# Altium project DC_CDI_Honda_CX500_rev2.1.PrjPcb
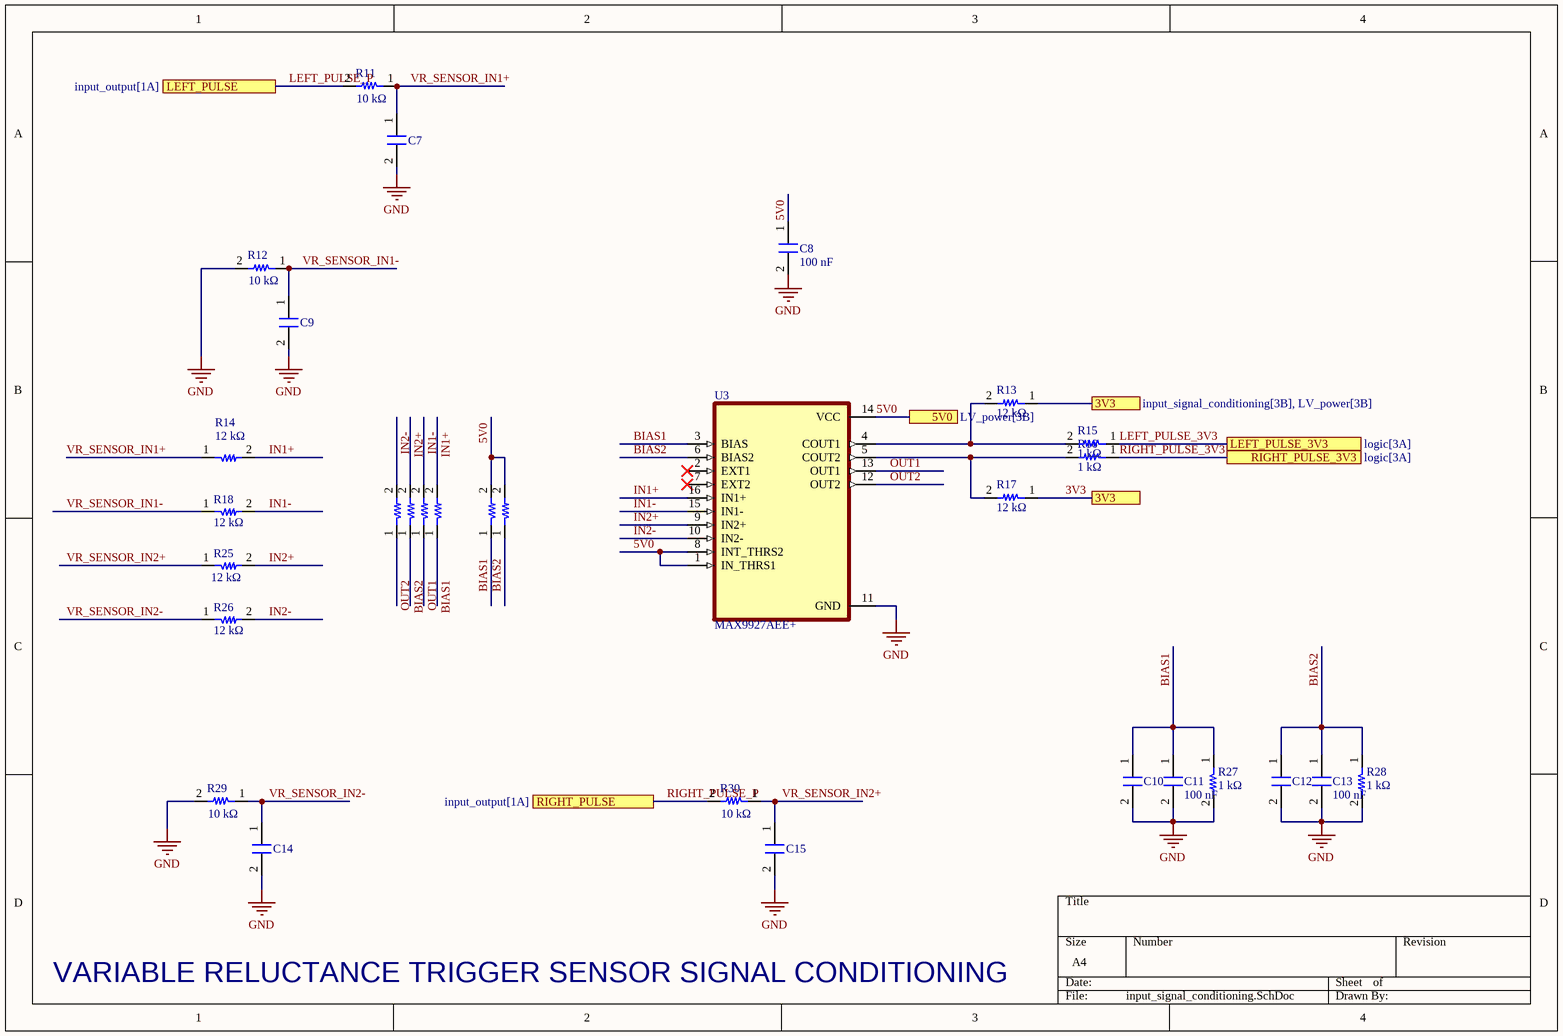
[diagram p0: input_signal_conditioning.SchDoc]
4 sheets, 117 parts. Net scope: flat (ports and power ports of the same name join across sheets).
Board file: dc_cdi_cx500.PcbDoc
Sheets:
  input_signal_conditioning.SchDoc
  logic.SchDoc
  HV_power.SchDoc
  LV_power.SchDoc

## Sheet input_signal_conditioning.SchDoc
size A4; SheetNumber: 3; SheetTotal: 6

### Parts
C7  Capacitor_0402  [0402_fp]  (value not drawn)
C8  value 100 nF  [0402_fp]  (hidden comment: Capacitor_0402)
C9  Capacitor_0402  [0402_fp]  (value not drawn)
C10  Capacitor_0603  [0603_FP]  (value not drawn)
C11  value 100 nF  [0402_fp]  (hidden comment: Capacitor_0402)
C12  Capacitor_0603  [0603_FP]  (value not drawn)
C13  value 100 nF  [0402_fp]  (hidden comment: Capacitor_0402)
C14  Capacitor_0402  [0402_fp]  (value not drawn)
C15  Capacitor_0402  [0402_fp]  (value not drawn)
R11  value 10 kΩ  [0402_fp]  (hidden comment: Resistor_0402)
R12  value 10 kΩ  [0402_fp]  (hidden comment: Resistor_0402)
R13  value 12 kΩ  [0402_fp]  (hidden comment: Resistor_0402)
R14  value 12 kΩ  [0402_fp]  (hidden comment: Resistor_0402)
R15  value 1 kΩ  [0402_fp]  (hidden comment: Resistor_0402)
R16  value 1 kΩ  [0402_fp]  (hidden comment: Resistor_0402)
R17  value 12 kΩ  [0402_fp]  (hidden comment: Resistor_0402)
R18  value 12 kΩ  [0402_fp]  (hidden comment: Resistor_0402)
R19  Resistor_0402  [0402_fp]  (value not drawn)
R20  Resistor_0402  [0402_fp]  (value not drawn)
R21  Resistor_0402  [0402_fp]  (value not drawn)
R22  Resistor_0402  [0402_fp]  (value not drawn)
R23  Resistor_0402  [0402_fp]  (value not drawn)
R24  Resistor_0402  [0402_fp]  (value not drawn)
R25  value 12 kΩ  [0402_fp]  (hidden comment: Resistor_0402)
R26  value 12 kΩ  [0402_fp]  (hidden comment: Resistor_0402)
R27  value 1 kΩ  [0402_fp]  (hidden comment: Resistor_0402)
R28  value 1 kΩ  [0402_fp]  (hidden comment: Resistor_0402)
R29  value 10 kΩ  [0402_fp]  (hidden comment: Resistor_0402)
R30  value 10 kΩ  [0402_fp]  (hidden comment: Resistor_0402)
U3  MAX9927AEE+  [SOP63P602X175-16N]

### Ports
3V3 (see input_signal_conditioning[3B], LV_power[3B]), 5V0 (see LV_power[3B]), LEFT_PULSE (see input_output[1A]), LEFT_PULSE_3V3 (see logic[3A]), RIGHT_PULSE (see input_output[1A]), RIGHT_PULSE_3V3 (see logic[3A])

### Nets
3V3: R13.1 R17.1 ; port 3V3
5V0: C8.1 R23.2 R24.2 U3.1(IN_THRS1) U3.8(INT_THRS2) U3.14(VCC) ; port 5V0
GND: C7.2 C8.2 C9.2 C10.2 C11.2 C12.2 C13.2 C14.2 C15.2 R12.2 R27.2 R28.2 R29.2 U3.11(GND)
BIAS1: C10.1 C11.1 R22.1 R23.1 R27.1 U3.3(BIAS)
BIAS2: C12.1 C13.1 R20.1 R24.1 R28.1 U3.6(BIAS2)
IN1+: R14.2 R22.2 U3.16(IN1+)
IN1-: R18.2 R21.2 U3.15(IN1-)
IN2+: R20.2 R25.2 U3.9(IN2+)
IN2-: R19.2 R26.2 U3.10(IN2-)
LEFT_PULSE_3V3: R15.1 ; port LEFT_PULSE_3V3
LEFT_PULSE_P: R11.2 ; port LEFT_PULSE
OUT1: R21.1 U3.13(OUT1)
OUT2: R19.1 U3.12(OUT2)
RIGHT_PULSE_3V3: R16.1 ; port RIGHT_PULSE_3V3
RIGHT_PULSE_P: R30.2 ; port RIGHT_PULSE
VR_SENSOR_IN1+: C7.1 R11.1 R14.1
VR_SENSOR_IN1-: C9.1 R12.1 R18.1
VR_SENSOR_IN2+: C15.1 R25.1 R30.1
VR_SENSOR_IN2-: C14.1 R26.1 R29.1
NetR13_2: R13.2 R15.2 U3.4(COUT1)
NetR16_2: R16.2 R17.2 U3.5(COUT2)

Not connected (* = marked no-connect by the designer): U3 2(EXT1)* 7(EXT2)*

### Notes on the sheet
- VARIABLE RELUCTANCE TRIGGER SENSOR SIGNAL CONDITIONING

### Library data of the parts
C7 C9 C14 C15 = Capacitor_0402: Value: 1 nF; Format: 0402; Package: 0402
C8 C11 C13 = Capacitor_0402: Format: 0402; Package: 0402
C10 C12 = Capacitor_0603: Value: 10 uF; Format: 0402; Package: 0402
R11-R18 R25-R30 = Resistor_0402: Format: 0402; Package: 0402
R19-R22 = Resistor_0402: Value: 12 kΩ; Format: 0402; Package: 0402
R23 R24 = Resistor_0402: Value: 1 kΩ; Format: 0402; Package: 0402
U3 = MAX9927AEE+: Variable-Reluctance Sensor Interface with Differential Input and Adaptive Peak Threshold; MF: Analog Devices; SnapEDA_Link: https://www.snapeda.com/parts/MAX9927AEE+/Analog+Devices/view-part/?ref=snap; Package: QSOP-16 Maxim; Value: *; MP: MAX9927AEE+; Check_prices: https://www.snapeda.com/parts/MAX9927AEE+/Analog+Devices/view-part/?ref=eda

## Sheet logic.SchDoc
size A4; SheetNumber: 4; SheetTotal: 6
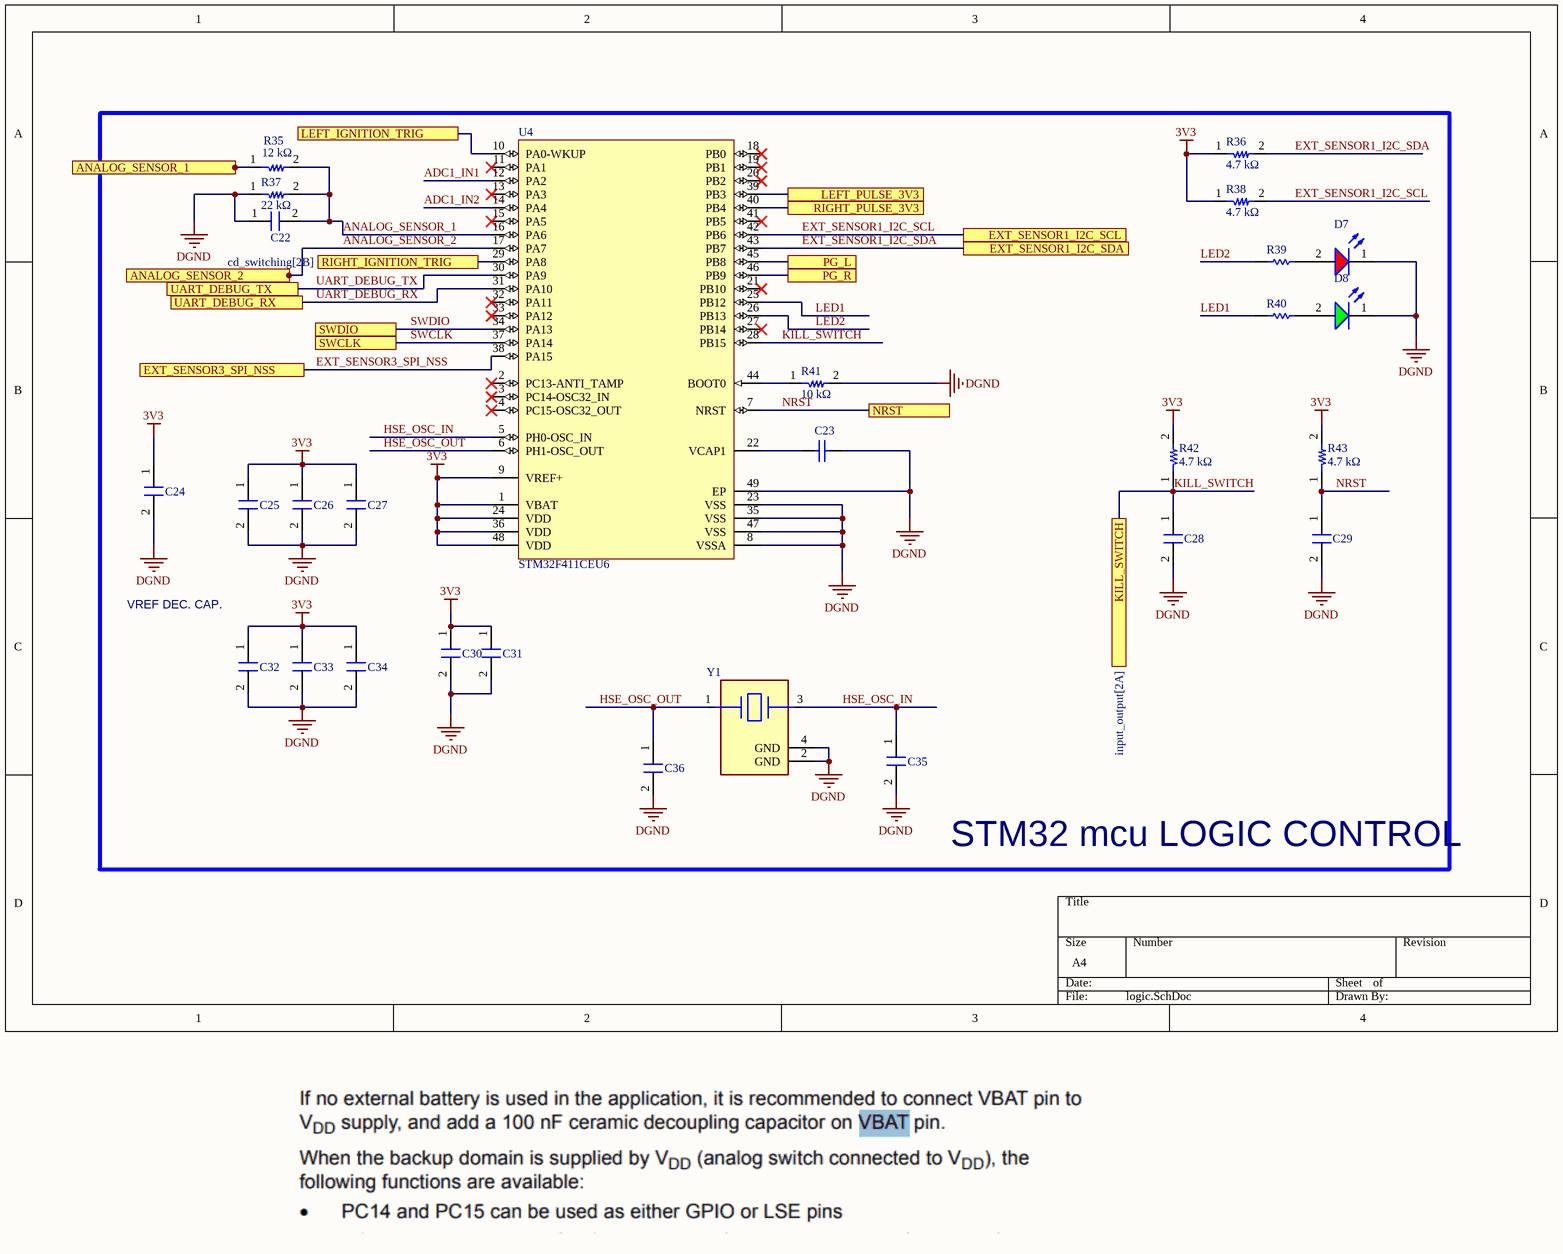
[diagram p1: logic.SchDoc]

### Parts
C22  Capacitor_0402  [0402_fp]  (value not drawn)
C23  0603ZD475MAT2A  [CAPC1608X90X35NL15T15]  (value not drawn)
C24  Capacitor_0402  [0402_fp]  (value not drawn)
C25  Capacitor_0402  [0402_fp]  (value not drawn)
C26  Capacitor_0402  [0402_fp]  (value not drawn)
C27  Capacitor_0402  [0402_fp]  (value not drawn)
C28  Capacitor_0402  [0402_fp]  (value not drawn)
C29  Capacitor_0402  [0402_fp]  (value not drawn)
C30  Capacitor_0402  [0402_fp]  (value not drawn)
C31  Capacitor_0402  [0402_fp]  (value not drawn)
C32  Capacitor_0402  [0402_fp]  (value not drawn)
C33  Capacitor_0402  [0402_fp]  (value not drawn)
C34  Capacitor_0402  [0402_fp]  (value not drawn)
C35  Capacitor_0603  [0603_FP]  (value not drawn)
C36  Capacitor_0603  [0603_FP]  (value not drawn)
D7  150080RS75000  [WL-SMCW_0805_150080xx75000]  (value not drawn)
D8  150080GS75000  [WL-SMCW_0805_150080xx75000]  (value not drawn)
R35  value 12 kΩ  [0402_fp]  (hidden comment: Resistor_0402)
R36  value 4.7 kΩ  [0402_fp]  (hidden comment: Resistor_0402)
R37  value 22 kΩ  [0402_fp]  (hidden comment: Resistor_0402)
R38  value 4.7 kΩ  [0402_fp]  (hidden comment: Resistor_0402)
R39  MCS04020D5600BE100  [RESC1005X37X20NL05T10]  (value not drawn)
R40  MCS04020D5600BE100  [RESC1005X37X20NL05T10]  (value not drawn)
R41  value 10 kΩ  [0402_fp]  (hidden comment: Resistor_0402)
R42  value 4.7 kΩ  [0402_fp]  (hidden comment: Resistor_0402)
R43  value 4.7 kΩ  [0402_fp]  (hidden comment: Resistor_0402)
U4  STM32F411CEU6  [STM-UFQFPN48_L]
Y1  NX3225GA-16.000M-STD-CRG-2  [FP-NX3225GA-MFG]  (value not drawn)

### Ports
ANALOG_SENSOR_1 (see input_output[1B]), ANALOG_SENSOR_2, EXT_SENSOR1_I2C_SCL (see input_output[1B]), EXT_SENSOR1_I2C_SDA (see input_output[1B]), EXT_SENSOR3_SPI_NSS, KILL_SWITCH (see input_output[2A]), LEFT_IGNITION_TRIG (see cd_switching[2B]), LEFT_PULSE_3V3 (see input_signal_conditioning[4B]), NRST (see input_output[3B]), PG_L (see HV_power[4B]), PG_R (see HV_power[4C]), RIGHT_IGNITION_TRIG (see cd_switching[2B]), RIGHT_PULSE_3V3 (see input_signal_conditioning[4B]), SWCLK (see input_output[3A]), SWDIO (see input_output[3A]), UART_DEBUG_RX (see input_output[2B], input_output[3C]), UART_DEBUG_TX (see input_output[2A], input_output[3B])

### Nets
3V3: C24.1 C25.1 C26.1 C27.1 C30.1 C31.1 C32.1 C33.1 C34.1 R36.1 R38.1 R42.2 R43.2 U4.1(VBAT) U4.9(VREF+) U4.24(VDD) U4.36(VDD) U4.48(VDD)
DGND: C22.1 C23.2 C24.2 C25.2 C26.2 C27.2 C28.2 C29.2 C30.2 C31.2 C32.2 C33.2 C34.2 C35.2 C36.2 D7.1(K) D8.1(K) R37.1 R41.2 U4.8(VSSA) U4.23(VSS) U4.35(VSS) U4.47(VSS) U4.49(EP) Y1.2(GND) Y1.4(GND)
ADC1_IN1: U4.12(PA2)
ADC1_IN2: U4.14(PA4)
ANALOG_SENSOR_1: C22.2 R35.2 R37.2 U4.16(PA6)
ANALOG_SENSOR_2: U4.17(PA7) ; port ANALOG_SENSOR_2
EXT_SENSOR1_I2C_SCL: R38.2 U4.42(PB6) ; port EXT_SENSOR1_I2C_SCL
EXT_SENSOR1_I2C_SDA: R36.2 U4.43(PB7) ; port EXT_SENSOR1_I2C_SDA
EXT_SENSOR3_SPI_NSS: U4.38(PA15) ; port EXT_SENSOR3_SPI_NSS
HSE_OSC_IN: C35.1 U4.5(PH0-OSC_IN) Y1.3
HSE_OSC_OUT: C36.1 U4.6(PH1-OSC_OUT) Y1.1
KILL_SWITCH: C28.1 R42.1 U4.28(PB15) ; port KILL_SWITCH
LED1: R40.1 U4.25(PB12)
LED2: R39.1 U4.26(PB13)
LEFT_PULSE_3V3: U4.39(PB3) ; port LEFT_PULSE_3V3
NRST: C29.1 R43.1 U4.7(NRST) ; port NRST
RIGHT_PULSE_3V3: U4.40(PB4) ; port RIGHT_PULSE_3V3
SWCLK: U4.37(PA14) ; port SWCLK
SWDIO: U4.34(PA13) ; port SWDIO
UART_DEBUG_RX: U4.31(PA10) ; port UART_DEBUG_RX
UART_DEBUG_TX: U4.30(PA9) ; port UART_DEBUG_TX
NetC23_1: C23.1 U4.22(VCAP1)
NetD7_2: D7.2(A) R39.2
NetD8_2: D8.2(A) R40.2
NetD11_1: U4.45(PB8) ; port PG_L
NetD14_1: U4.46(PB9) ; port PG_R
NetR35_1: R35.1 ; port ANALOG_SENSOR_1
NetR41_1: R41.1 U4.44(BOOT0)
NetU4_10: U4.10(PA0-WKUP) ; port LEFT_IGNITION_TRIG
NetU4_29: U4.29(PA8) ; port RIGHT_IGNITION_TRIG

Not connected (* = marked no-connect by the designer): U4 2(PC13-ANTI_TAMP)* 3(PC14-OSC32_IN)* 4(PC15-OSC32_OUT)* 11(PA1)* 13(PA3)* 15(PA5)* 18(PB0)* 19(PB1)* 20(PB2)* 21(PB10)* 27(PB14)* 32(PA11)* 33(PA12)* 41(PB5)*

### Notes on the sheet
- VREF DEC. CAP.
- STM32 mcu LOGIC CONTROL

### Library data of the parts
C22 = Capacitor_0402: Value: 1 nF; Format: 0402; Package: 0402
C23 = CMP-1035-02787-2: Manufacturer: AVX Interconnect / Elco; Part Number: 0603ZD475MAT2A
C24 C28 C29 = Capacitor_0402: Value: 100 nF; Format: 0402; Package: 0402
C25-C27 C30-C34 = Capacitor_0402: Value: 10 nF; Format: 0402; Package: 0402
C35 C36 = Capacitor_0603: Value: 10 pF; Format: 0402; Package: 0402
D7 = CMP-1426-00011-3: LED Uni-Color Red 630nm 2-Pin Chip 0805(2012Metric) T/R; Viewing Angle: 140°; Max Junction Temperature (Tj): 95°C; Power Dissipation: 72mW; Forward Current: 100mA; Forward Voltage: 2V; Wavelength: 625nm; Test Current: 20mA; Max Reverse Voltage (DC): 5V; Luminous Intensity: 150mcd; Lens Style: Clear, Rectangular; REACH SVHC: Unknown; Height: 700µm; Case Code (Metric): 2012; Peak Wavelength: 630nm; Length: 2mm; Width: 1.25mm; RoHS: Compliant; Packaging: Tape and Reel; Dominant Wavelength: 625nm; Color: Red; Case Code (Imperial): 0805; Min Operating Temperature: -40°C; Mount: Surface Mount; Max Operating Temperature: 85°C; Case/Package: 0805
D8 = CMP-1426-00007-3: WURTH ELEKTRONIK - 150080GS75000 - LED, Green, SMD, 0805, 30 mA, 3.2 V, 520 nm; Forward Voltage: 3.2V; Viewing Angle: 140°; Power Dissipation: 105mW; Peak Wavelength: 515nm; Max Reverse Voltage (DC): 5V; Luminous Intensity: 450mcd; Wavelength: 525nm; Max Junction Temperature (Tj): 95°C; Forward Current: 100mA; Test Current: 20mA; Lens Style: Clear, Rectangular; Length: 2mm; Case/Package: 0805; Case Code (Metric): 2012; Color: Green; Height: 700µm; Width: 1.25mm; Packaging: Tape and Reel; Mount: Surface Mount; REACH SVHC: Unknown; RoHS: Compliant; Min Operating Temperature: -40°C; Reverse Voltage: 5V; Max Operating Temperature: 85°C; Dominant Wavelength: 525nm; Case Code (Imperial): 0805
R39 R40 = CMP-2002-02518-1: Manufacturer: Vishay BCcomponents; Part Number: MCS04020D5600BE100
U4 = CMP-0243-00165-1: ARM Cortex-M4 32-bit MCU+FPU, 512 KB Flash, 128 KB RAM, 36 I/Os, 48-Pin UFQFPN, -40 to 85 degC, Tray; Operating Frequency(F) (Processor speed) (MHz): 100; FLASH Size (Prog) (kB): 512; Internal RAM Size (kB): 128; I/Os (High Current): 36; Supply Voltage(Vcc) min (V): 1.7; Package Reference: 48-Pin Ultra Thin Fine Pitch Quad Flat No-Lead, 7 x 7 x 0.6 mm Body, 0.5 mm Pitch, Exposed Pad; ComponentLink1Description: Manufacturer URL; ComponentLink1URL: http://www.st.com/; Packing: Tray; Package Description: UFQFPN48; Core: ARM Cortex-M4; ComponentLink2Description: Datasheet; ComponentLink2URL: http://www.st.com/st-web-ui/static/active/en/resource/technical/document/datasheet/DM00115249.pdf; DatasheetVersion: Rev. 6; Mounting Technology: Surface Mount
Y1 = CMP-200220-000007-1: CRYSTAL 16.0000MHZ 8PF SMD; Frequency Stability: 30ppm; Frequency Tolerance: 20ppm; Frequency: 16MHz; ESR (Equivalent Series Resistance): 80R; Min Operating Temperature: -40°C; Mount: Surface Mount; Width: 0.098inch; Case/Package: SMD/SMT; Max Operating Temperature: 85°C; Number of Pins: 4; Length: 0.126inch; Load Capacitance: 8pF; Packaging: Tape and Reel; Package Quantity: 3000; Height: 0.035inch
R35-R38 R41-R43 = Resistor_0402: Package: 0402

## Sheet HV_power.SchDoc
size A4; SheetNumber: 5; SheetTotal: 6
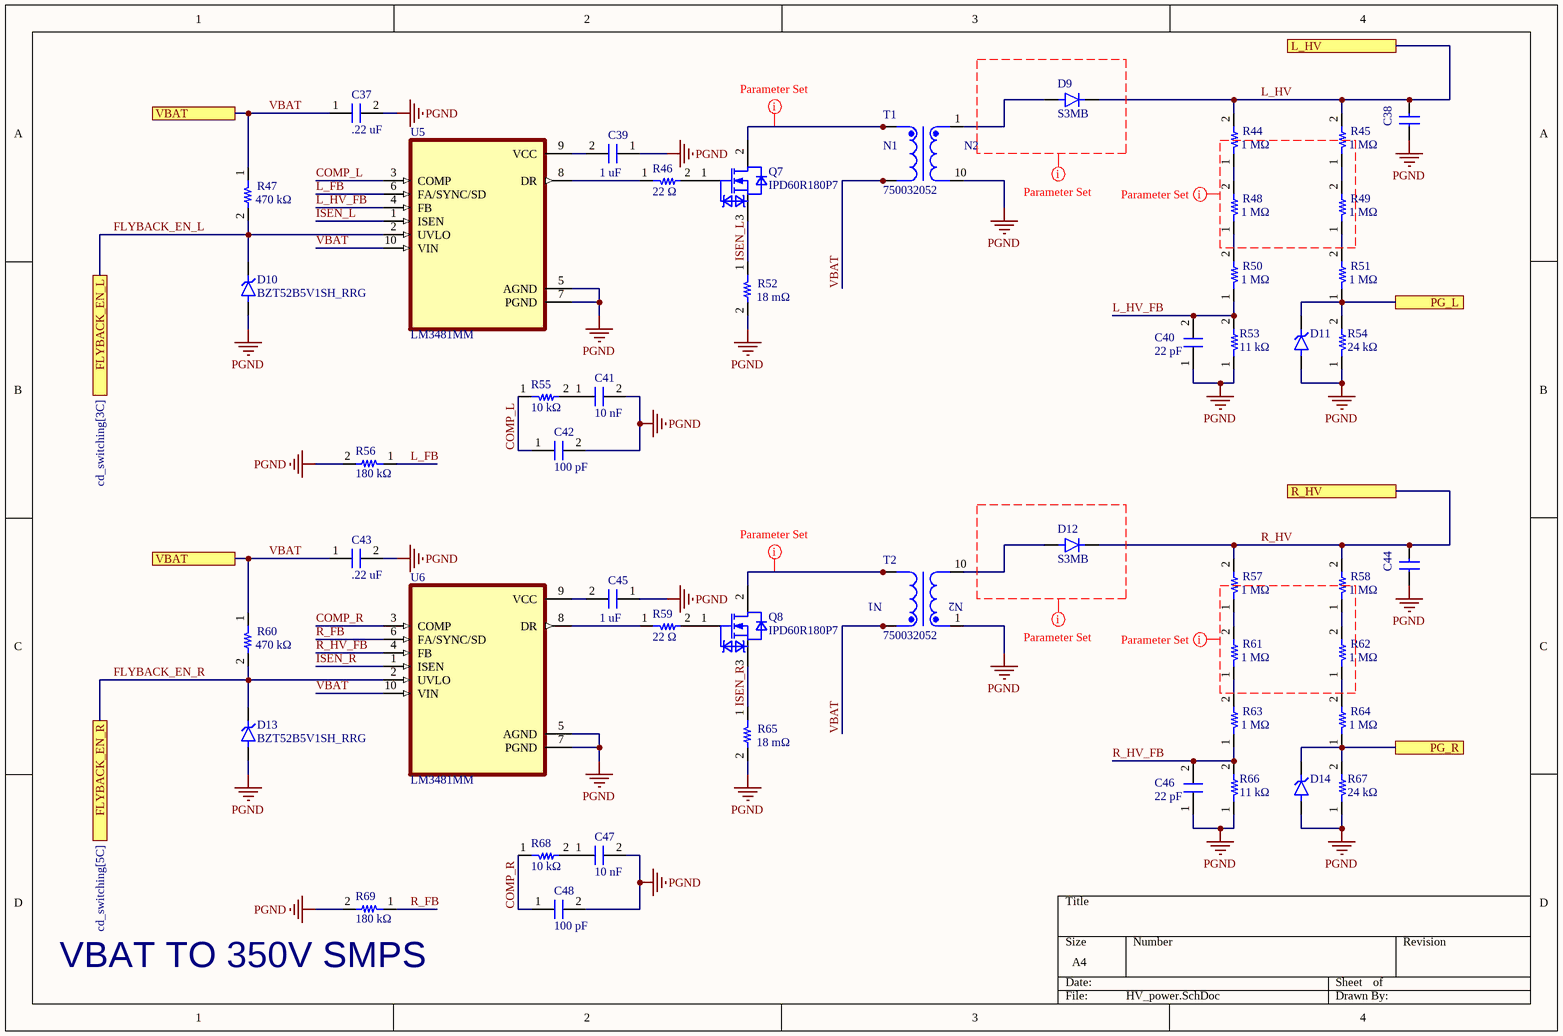
[diagram p2: HV_power.SchDoc]

### Parts
C37  value .22 uF  [0603_FP]  (hidden comment: GRM21BR61C475KA88L)
C38  WCAP-FTBP_P10  [WCAP-FTBP_10X13X5.5X11(PXLXWXH)]  (value not drawn)
C39  value 1 uF  [0603_FP]  (hidden comment: Capacitor_0603)
C40  value 22 pF  [0603_FP]  (hidden comment: Capacitor_0603)
C41  value 10 nF  [0603_FP]  (hidden comment: Capacitor_0603)
C42  value 100 pF  [0603_FP]  (hidden comment: Capacitor_0603)
C43  value .22 uF  [0603_FP]  (hidden comment: GRM21BR61C475KA88L)
C44  WCAP-FTBP_P10  [WCAP-FTBP_10X13X5.5X11(PXLXWXH)]  (value not drawn)
C45  value 1 uF  [0603_FP]  (hidden comment: Capacitor_0603)
C46  value 22 pF  [0603_FP]  (hidden comment: Capacitor_0603)
C47  value 10 nF  [0603_FP]  (hidden comment: Capacitor_0603)
C48  value 100 pF  [0603_FP]  (hidden comment: Capacitor_0603)
D9  S3MB  [DIOM4336X265N]
D10  BZT52B5V1SH_RRG  [DIO_BZT52B5V1SH_RRG]
D11  BZT52B15SH_RRG  [DIO_BZT52B15SH_RRG]  (value not drawn)
D12  S3MB  [DIOM4336X265N]
D13  BZT52B5V1SH_RRG  [DIO_BZT52B5V1SH_RRG]
D14  BZT52B15SH_RRG  [DIO_BZT52B15SH_RRG]  (value not drawn)
Q7  IPD60R180P7  [DPAK228P987X240-3N]
Q8  IPD60R180P7  [DPAK228P987X240-3N]
R44  value 1 MΩ  [0805_FP]  (hidden comment: R_0805)
R45  value 1 MΩ  [0805_FP]  (hidden comment: R_0805)
R46  value 22 Ω  [0603_FP]  (hidden comment: Resistor_0603)
R47  value 470 kΩ  [0603_FP]  (hidden comment: Resistor_0603)
R48  value 1 MΩ  [0805_FP]  (hidden comment: R_0805)
R49  value 1 MΩ  [0805_FP]  (hidden comment: R_0805)
R50  value 1 MΩ  [0805_FP]  (hidden comment: R_0805)
R51  value 1 MΩ  [0805_FP]  (hidden comment: R_0805)
R52  value 18 mΩ  [2010_FP]  (hidden comment: 2010_res)
R53  value 11 kΩ  [0805_FP]  (hidden comment: R_0805)
R54  value 24 kΩ  [0805_FP]  (hidden comment: R_0805)
R55  value 10 kΩ  [0603_FP]  (hidden comment: Resistor_0603)
R56  value 180 kΩ  [0603_FP]  (hidden comment: Resistor_0603)
R57  value 1 MΩ  [0805_FP]  (hidden comment: R_0805)
R58  value 1 MΩ  [0805_FP]  (hidden comment: R_0805)
R59  value 22 Ω  [0603_FP]  (hidden comment: Resistor_0603)
R60  value 470 kΩ  [0603_FP]  (hidden comment: Resistor_0603)
R61  value 1 MΩ  [0805_FP]  (hidden comment: R_0805)
R62  value 1 MΩ  [0805_FP]  (hidden comment: R_0805)
R63  value 1 MΩ  [0805_FP]  (hidden comment: R_0805)
R64  value 1 MΩ  [0805_FP]  (hidden comment: R_0805)
R65  value 18 mΩ  [2010_FP]  (hidden comment: 2010_res)
R66  value 11 kΩ  [0805_FP]  (hidden comment: R_0805)
R67  value 24 kΩ  [0805_FP]  (hidden comment: R_0805)
R68  value 10 kΩ  [0603_FP]  (hidden comment: Resistor_0603)
R69  value 180 kΩ  [0603_FP]  (hidden comment: Resistor_0603)
T1  750032052  [WE-FB3751_EFD20]
T2  750032052  [WE-FB3751_EFD20]
U5  LM3481MM  [SOP50P490X110-10N]
U6  LM3481MM  [SOP50P490X110-10N]

### Ports
FLYBACK_EN_L (see cd_switching[3C]), FLYBACK_EN_R (see cd_switching[5C]), L_HV (see cd_switching[4A]), PG_L (see logic[3B]), PG_R (see logic[3B]), R_HV (see cd_switching[6B]), VBAT (see cd_switching[3A], cd_switching[3B], HV_power[1A], input_output[2D], LV_power[1B]), VBAT (see cd_switching[3A], cd_switching[3B], HV_power[1C], input_output[2D], LV_power[1B])

### Nets
PGND: C37.2 C38.1 C39.1 C40.1 C41.2 C42.2 C43.2 C44.1 C45.1 C46.1 C47.2 C48.2 D10.2(A) D11.2(A) D13.2(A) D14.2(A) R52.2 R53.1 R54.1 R56.2 R65.2 R66.1 R67.1 R69.2 T1.10 T2.1 U5.5(AGND) U5.7(PGND) U6.5(AGND) U6.7(PGND)
COMP_L: C42.1 R55.1 U5.3(COMP)
COMP_R: C48.1 R68.1 U6.3(COMP)
FLYBACK_EN_L: D10.1(K) R47.2 U5.2(UVLO) ; port FLYBACK_EN_L
FLYBACK_EN_R: D13.1(K) R60.2 U6.2(UVLO) ; port FLYBACK_EN_R
ISEN_L: Q7.3(SOURCE) R52.1 U5.1(ISEN)
ISEN_R: Q8.3(SOURCE) R65.1 U6.1(ISEN)
L_FB: R56.1 U5.6(FA/SYNC/SD)
L_HV: C38.2 D9.C(K) R44.2 R45.2 ; port L_HV
L_HV_FB: C40.2 R50.1 R53.2 U5.4(FB)
R_FB: R69.1 U6.6(FA/SYNC/SD)
R_HV: C44.2 D12.C(K) R57.2 R58.2 ; port R_HV
R_HV_FB: C46.2 R63.1 R66.2 U6.4(FB)
VBAT: C37.1 C43.1 R47.1 R60.1 T1.4(4+5) T1.5(4+5) T2.6(6+7) T2.7(6+7) U5.10(VIN) U6.10(VIN) ; port VBAT
NetC39_2: C39.2 U5.9(VCC)
NetC41_1: C41.1 R55.2
NetC45_2: C45.2 U6.9(VCC)
NetC47_1: C47.1 R68.2
NetD9_A: D9.A T1.1
NetD11_1: D11.1(K) R51.1 R54.2 ; port PG_L
NetD12_A: D12.A T2.10
NetD14_1: D14.1(K) R64.1 R67.2 ; port PG_R
NetQ7_1: Q7.1(GATE) R46.2
NetQ7_2: Q7.2(DRAIN) T1.6(6+7) T1.7(6+7)
NetQ8_1: Q8.1(GATE) R59.2
NetQ8_2: Q8.2(DRAIN) T2.4(4+5) T2.5(4+5)
NetR44_1: R44.1 R48.2
NetR45_1: R45.1 R49.2
NetR46_1: R46.1 U5.8(DR)
NetR48_1: R48.1 R50.2
NetR49_1: R49.1 R51.2
NetR57_1: R57.1 R61.2
NetR58_1: R58.1 R62.2
NetR59_1: R59.1 U6.8(DR)
NetR61_1: R61.1 R63.2
NetR62_1: R62.1 R64.2

### Layout directives
net class HV_NETS: (no net found under the mark), NetQ7_2, NetQ8_2
net class FB_NETS: (no net found under the mark)

### Notes on the sheet
- (near R69) VBAT TO 350V SMPS
- (in symbol 750032052) N1; N2

### Library data of the parts
C37 C39-C43 C45-C48 = Capacitor_0603: Format: 0402; Package: 0402
C38 C44 = WCAP-FTBP_P10: MPPP010104J400DCPP55004; THT Boxed; 100 nF Â± 5 %; 400V (DC); RIso â‰¥ 30 GÎ©; pitch 10; Climate category 40/105/56; MF: Wurth Elektronik; MP: 890283323005CS; SnapEDA_Link: https://www.snapeda.com/parts/890283323005CS/Wurth+Electronics/view-part/?ref=snap; Package: None; Value: *; Check_prices: https://www.snapeda.com/parts/890283323005CS/Wurth+Electronics/view-part/?ref=eda
D9 D12 = S3MB: 3A, 1000V, Standard Recovery Rectifier; MF: Taiwan Semiconductor; SnapEDA_Link: https://www.snapeda.com/parts/S3MB/taiwan/view-part/?ref=snap; Package: SMD-2 Taiwan Semiconductor; Value: *; MP: S3MB; Check_prices: https://www.snapeda.com/parts/S3MB/taiwan/view-part/?ref=eda
D10 D13 = BZT52B5V1SH_RRG: SOD-323, 200mW, 2%, 5.1V, Zener Diode; MF: Taiwan Semiconductor Corporation; MP: BZT52B5V1SH RRG; SnapEDA_Link: https://www.snapeda.com/parts/BZT52B5V1SH%20RRG/Taiwan+Semiconductor+Corporation/view-part/?ref=snap; Package: SOD-323-2 Taiwan Semiconductor; Value: *; Check_prices: https://www.snapeda.com/parts/BZT52B5V1SH%20RRG/Taiwan+Semiconductor+Corporation/view-part/?ref=eda
D11 D14 = BZT52B15SH_RRG: SOD-323, 200mW, 2%, 15V, Zener Diode; MF: Taiwan Semiconductor Corporation; MP: BZT52B15SH RRG; SnapEDA_Link: https://www.snapeda.com/parts/BZT52B15SH%20RRG/Taiwan+Semiconductor+Corporation/view-part/?ref=snap; Package: SOD-323-2 Taiwan Semiconductor; Value: *; Check_prices: https://www.snapeda.com/parts/BZT52B15SH%20RRG/Taiwan+Semiconductor+Corporation/view-part/?ref=eda
Q7 Q8 = IPD60R180P7: Insulated-Gate Field-Effect Transistor (IGFET), N-Channel, Enhancement, Body Diode, ESD Diode Gate/Source, Pin 1 Gate, 2 Drain, 3 Source, 3 Pins; Manufacturer: Infineon Technologies; PackageReference: PG-TO252-3-342; Manufacturer Order Number: IPD60R180P7
R46 R47 R55 R56 R59 R60 R68 R69 = Resistor_0603: Format: 0402; Package: 0402
T1 T2 = 750032052: L= 10ÂµH, Turns ratio 10:1; Iprim=10A; suitable for LT3750; Vin = 3-24V typ.; Vout = variable 300V typ.; fswitch = 100-400kHz; MF: Wurth Electronics; SnapEDA_Link: https://www.snapeda.com/parts/750032052/Wurth+Electronics/view-part/?ref=snap; Package: None; Value: *; MP: 750032052; Check_prices: https://www.snapeda.com/parts/750032052/Wurth+Electronics/view-part/?ref=eda
U5 U6 = LM3481MM: 2.97V to 48V High-Efficiency Controller for Boost, SEPIC and Flyback; MF: Texas Instruments; MP: LM3481MM/NOPB; SnapEDA_Link: https://www.snapeda.com/parts/LM3481MM/NOPB/Texas+Instruments/view-part/?ref=snap; Package: VSSOP-10 Texas Instruments; Value: *; Check_prices: https://www.snapeda.com/parts/LM3481MM/NOPB/Texas+Instruments/view-part/?ref=eda

## Sheet LV_power.SchDoc
size A4; SheetNumber: 6; SheetTotal: 6
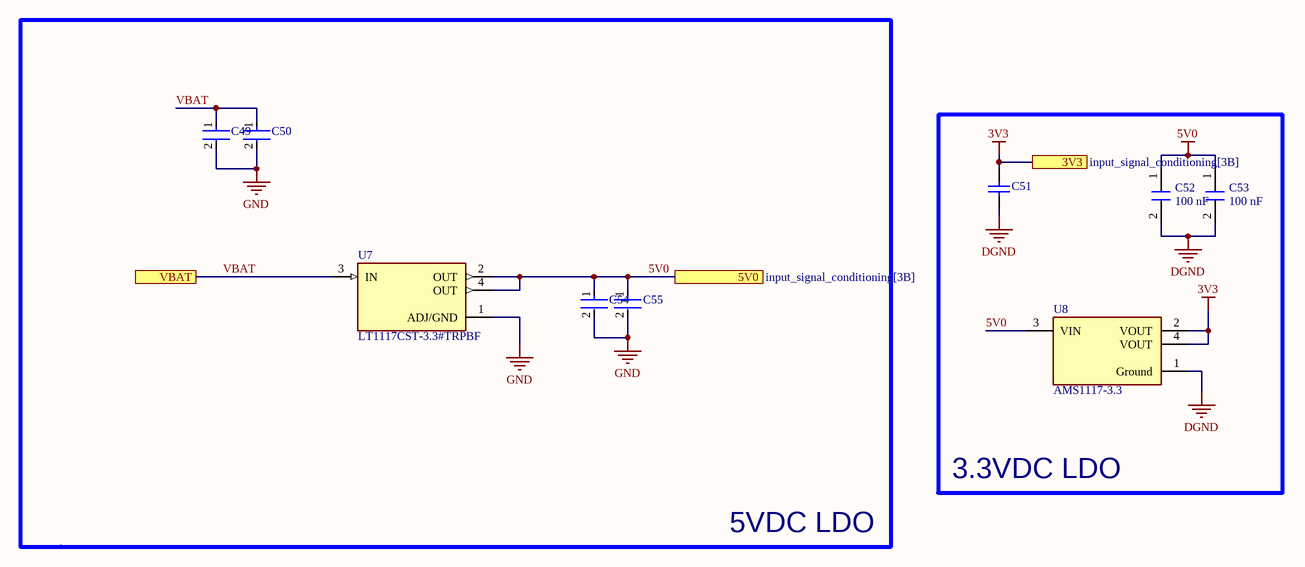
[diagram p3: LV_power.SchDoc]

### Parts
C49  CC0805MKX5R8BB226  [FP-CC0805-0_2-1_45-IPC_C]  (value not drawn)
C50  CC0805MKX5R8BB226  [FP-CC0805-0_2-1_45-IPC_C]  (value not drawn)
C51  0805ZG106ZAT2A  [CAPC2013X152X50NL20T25]  (value not drawn)
C52  value 100 nF  [0603_FP]  (hidden comment: Capacitor_0603)
C53  value 100 nF  [0603_FP]  (hidden comment: Capacitor_0603)
C54  GRM21BR61A476ME15K  [FP-GRM21B-0_2-e0_2_0_7-IPC_B]  (value not drawn)
C55  GRM21BR61A476ME15K  [FP-GRM21B-0_2-e0_2_0_7-IPC_B]  (value not drawn)
U7  LT1117CST-3.3#TRPBF  [REG_LT1117CST-3.3#TRPBF]
U8  AMS1117-3.3  [FP-AMS1117-IPC_C]

### Blocks framed on the sheet
5VDC LDO: C49 C50 C54 C55 U7
3.3VDC LDO: C51-C53 U8

### Ports
3V3 (see input_signal_conditioning[3B]), 5V0 (see input_signal_conditioning[3B]), VBAT (see cd_switching[3A], cd_switching[3B], HV_power[1A], HV_power[1C], input_output[2D])

### Nets
3V3: C51.2 U8.2(VOUT) U8.4(VOUT) ; port 3V3
5V0: C52.1 C53.1 C54.1 C55.1 U7.2(OUT) U7.4(OUT) U8.3(VIN) ; port 5V0
DGND: C51.1 C52.2 C53.2 U8.1(Ground)
GND: C49.2 C50.2 C54.2 C55.2 U7.1(ADJ/GND)
VBAT: C49.1 C50.1 U7.3(IN) ; port VBAT

### Library data of the parts
C49 C50 = CMP-03422-001497-1: CAP CER 22UF 25V X5R 0805; Tolerance: 20%; Max Operating Temperature: 85°C; Dielectric: X5R; Termination: SMD/SMT; Voltage Rating: 25V; Width: 0.049inch; Min Operating Temperature: -55°C; Case/Package: 0805; Lead Free: Lead Free; RoHS Compliant: Yes; Weight: 0.000194oz; Voltage Rating (DC): 25V; Capacitance: 22uF; Length: 0.079inch; Halogen Free: Halogen Free; Height: 1.25mm; Packaging: Tape and Reel; Package Quantity: 3000; Case Code (Metric): 2012; Thickness: 0.057inch; Case Code (Imperial): 0805; Mount: Surface Mount
C51 = CMP-2007-04523-1: Manufacturer: AVX Interconnect / Elco; Part Number: 0805ZG106ZAT2A
C52 C53 = Capacitor_0603: Format: 0402; Package: 0402
C54 C55 = CMP-06035-042633-1: Chip Multilayer Ceramic Capacitors for General Purpose, 0805, 47uF, X5R, 15%, 20%, 10V; Min Operating Temperature: -55°C; Max Operating Temperature: 85°C; Length: 0.079inch; Case Code (Imperial): 0805; Tolerance: 20%; Mount: Surface Mount; Voltage Rating (DC): 10V; Termination: SMD/SMT; Voltage Rating: 10V; Weight: 0.000335oz; Package Quantity: 10000; Dielectric: X5R; Thickness: 0.057inch; Capacitance: 47uF; Case/Package: 0805; Width: 0.049inch; Case Code (Metric): 2012; Packaging: Tape and Reel
U7 = LT1117CST-3.3#TRPBF: LT1117 - 800mA Low Dropout Positive Regulators Adjustable and Fixed 2.85V, 3.3V, 5V; MF: {'manufacturer': u'Analog Devices Inc.'}; Package: None; Price: None; Value: *; MP: LT1117CST-3.3#TRPBF; Availability: Unavailable
U8 = CMP-209535-000001-1: LDO Voltage Regulators 1A, 3.3V; Manufacturer: Advanced Monolithic Systems; Dropout Voltage: 1.1V; Output Type: Fixed; Nominal Supply Current: 5mA; Max Power Dissipation: 1.2W; Max Supply Voltage: 15V; Number Of Outputs: 1; Standoff Height: 0.64mm; Max Junction Temp: +125°C; Height: 1.8mm; Package: AMS1117; Device Class L2: Power Management ICs; ComponentLink2Description: Datasheet; ComponentLink2URL: http://www.advanced-monolithic.com/pdf/ds1117.pdf; Category: IC; RoHS: TRUE; Automotive: No; Device Class L1: Integrated Circuits (ICs); Output Current: 1A; Device Class L3: Voltage Regulators - Linear; Temperature: -40°C to +125°C; Output Voltage: 3.3V; Manufacturer Part Number: AMS1117-3.3; Temperature Range Low: -40°C; Octopart: https://octopart.com/ams1117-3.3-advanced+monolithic+systems-25899300; Lead Free: Yes; Ipc Land Pattern Name: SOT229P700X180-4; Temperature Range High: +125°C

## Nets that join several sheets
3V3: input_signal_conditioning (R13.1 R17.1), logic (18 pins), LV_power (C51.2 U8.2 U8.4)
5V0: input_signal_conditioning (6 pins), LV_power (7 pins)
DGND: logic (26 pins), LV_power (C51.1 C52.2 C53.2 U8.1)
GND: input_signal_conditioning (14 pins), LV_power (5 pins)
LEFT_PULSE_3V3: input_signal_conditioning (R15.1), logic (U4.39)
NetD11_1: logic (U4.45), HV_power (D11.1 R51.1 R54.2)
NetD14_1: logic (U4.46), HV_power (D14.1 R64.1 R67.2)
RIGHT_PULSE_3V3: input_signal_conditioning (R16.1), logic (U4.40)
VBAT: HV_power (10 pins), LV_power (C49.1 C50.1 U7.3)